# EasyEDA Pro project ProDoc_simpleCH552_typeA_start.epro

# Schematic simpleCH552_typeA_start
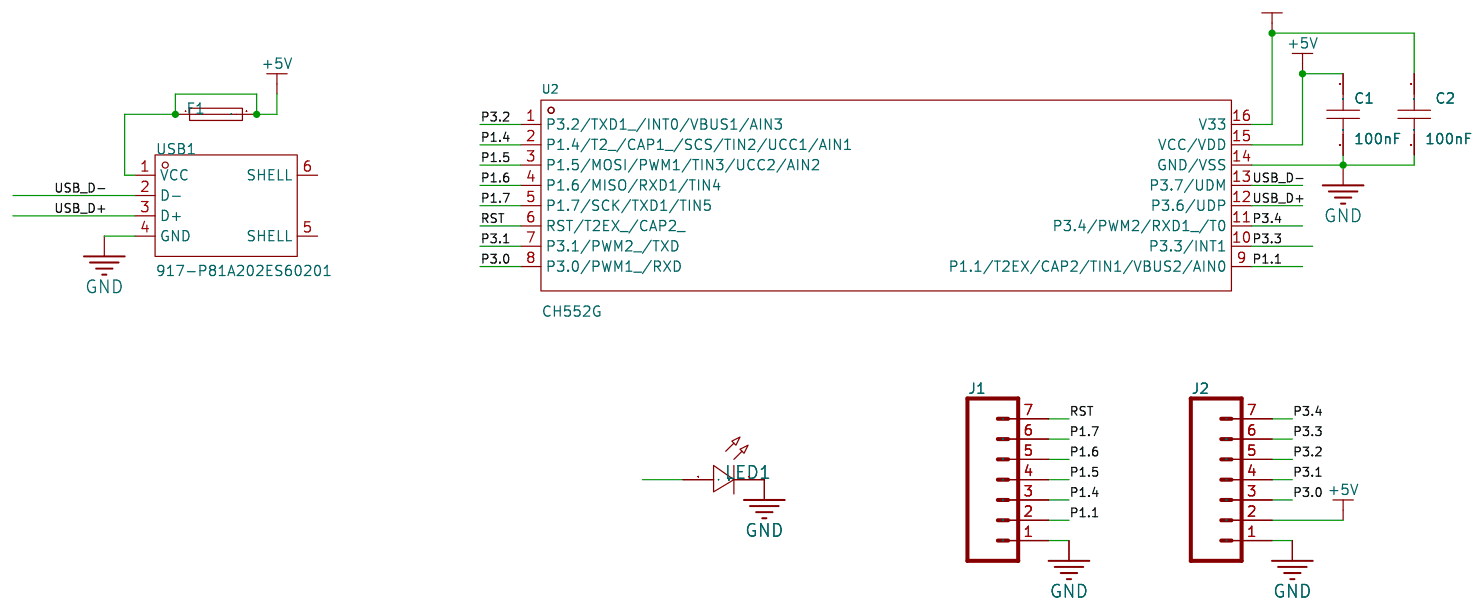
[diagram p0: schematic sheet]

## Parts
C1  100nF  [C0805]
C2  100nF  [C0805]
F1  SF-1206S080-2  [F1206]  (no BOM)
J1  CONN_07NO_SILK  [1X07_NO_SILK]
J2  CONN_07NO_SILK  [1X07_NO_SILK]
LED1  -  [LED0805-RD_GREEN]
U2  CH552G  [SOP-16_L10.0-W3.9-P1.27-LS6.0-BL]
USB1  917-P81A202ES60201  [USB-A-SMD_917-P81A202ES60201]

## Library data of the parts
C1 C2 = CAP_0805: Supplier Footprint: 0805
F1 = SF-1206S080-2: Supplier Part: C3032873; Manufacturer: BOURNS; Supplier Footprint: 1206; JLCPCB Part Class: Extended Part; Datasheet: https://atta.szlcsc.com/upload/public/pdf/source/20220608/65EEC60D8433527F377077C8BDEE03B0.pdf; Supplier: LCSC
J1 J2 = SparkFun-Connectors_CONN_07_NO_SILK
LED1 = LED_0805-R: Supplier Footprint: 0805
U2 = CH552G: CPU Core:51 Series CPU Maximum Speed:24MHz Program Storage Size:16KB Program Memory Type:FLASH ADC (Bit):8bit PWM (Bit):8bit Voltage - Supply:3.3V~5V Voltage - Supply:3.3V~5V Applications:-; LCSC Part Name: 8位增强型USB单片机; Supplier Part: C111292; Manufacturer: WCH(南京沁恒); Supplier Footprint: SOP-16; JLCPCB Part Class: Extended Part; Datasheet: https://item.szlcsc.com/datasheet/CH552G/112518.html; Supplier: LCSC; CPU Core: 51 Series; CPU Maximum Speed: 24MHz; Program Storage Size: 16KB; Program Memory Type: FLASH; ADC (Bit): 8bit; PWM (Bit): 8bit; Voltage - Supply: 3.3V~5V
USB1 = 917-P81A202ES60201: Connector Type:Type-A Standard:USB 2.0 Gender:公 Number of Ports:1 Number of Contacts:4P Mounting Style:Sink board Current Rating - Power (Max):1.5A Operating Temperature Range:- Operating Temperature Range:-; LCSC Part Name: Type-A 公 沉板; Supplier Part: C2763091; Manufacturer: 精拓金; Supplier Footprint: SMD; JLCPCB Part Class: Extended Part; Datasheet: https://atta.szlcsc.com/upload/public/pdf/source/20210526/C2763091_74908644C363FC7F8BB851C47F8BF5A9.pdf; Supplier: LCSC; Connector Type: Type-A; Standard: USB 2.0; Gender: 公; Number of Ports: 1; Number of Contacts: 4P; Mounting Style: Sink board; Current Rating - Power (Max): 1.5A

## Nets
3.3V: C2.1 U2.16(V33)
+5V: C1.1 F1.1 F1.2 J2.2 U2.15(VCC/VDD) USB1.1(VCC)
GND: C1.2 C2.2 J1.1 J2.1 LED1.1(C) U2.14(GND/VSS) USB1.4(GND)
N$3: LED1.2(A)
P1.1: J1.2 U2.9(P1.1/T2EX/CAP2/TIN1/VBUS2/AIN0)
P1.4: J1.3 U2.2(P1.4/T2_/CAP1_/SCS/TIN2/UCC1/AIN1)
P1.5: J1.4 U2.3(P1.5/MOSI/PWM1/TIN3/UCC2/AIN2)
P1.6: J1.5 U2.4(P1.6/MISO/RXD1/TIN4)
P1.7: J1.6 U2.5(P1.7/SCK/TXD1/TIN5)
P3.0: J2.3 U2.8(P3.0/PWM1_/RXD)
P3.1: J2.4 U2.7(P3.1/PWM2_/TXD)
P3.2: J2.5 U2.1(P3.2/TXD1_/INT0/VBUS1/AIN3)
P3.3: J2.6 U2.10(P3.3/INT1)
P3.4: J2.7 U2.11(P3.4/PWM2/RXD1_/T0)
RST: J1.7 U2.6(RST/T2EX_/CAP2_)
USB_D+: U2.12(P3.6/UDP) USB1.3(D+)
USB_D-: U2.13(P3.7/UDM) USB1.2(D-)

Not connected (* = marked no-connect by the designer): USB1 5(SHELL) 6(SHELL)

# Board simpleCH552_typeA_start
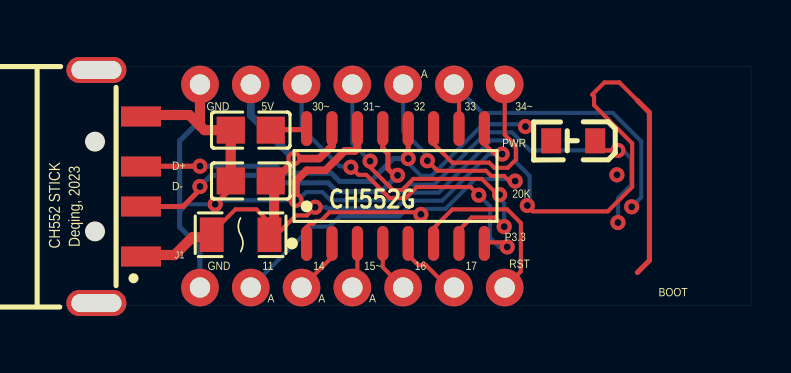
[diagram p1: board, top side]
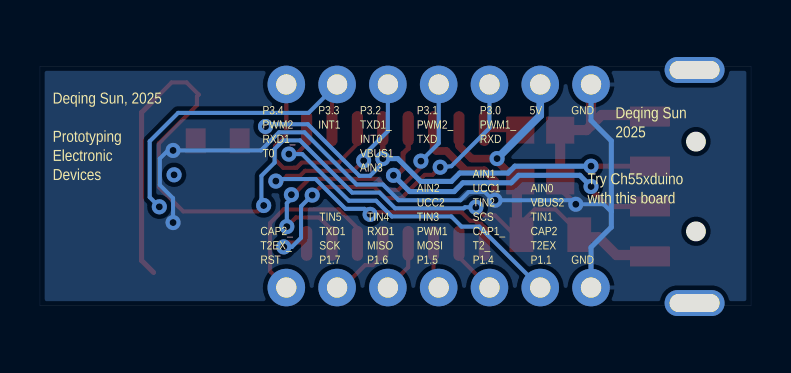
[diagram p2: board, bottom side, seen from below]

Outline 35.56 x 11.99 mm; copper layers: Top Layer, Bottom Layer. Coordinates in mm from the lower left corner of the outline.
Outline path: 0,11.99 0,0 35.56,0 35.56,11.99 0,11.99
Stack: Top Layer 0.035mm / Dielectric1 1.51mm FR4 er 4.5 / Bottom Layer 0.035mm

## Design rules (mm)
template: User Custom Config
spacing safeClearance (default): track to track 0.203, other pairs 0 to 0.508
track width trackWidth: min 0.203, default 0.203, max 2.54
track width default (default): min 0.003, default 0.003, max 2.54
differential pair differentialPair (default): width min 0.127, default 0.254, max 2.54; gap min 0.152, default 0.152
via viaSize: diameter min 0.3, default 0.3, max 2.6; hole min 0.3, default 0.3, max 2
via default (default): diameter min 0, default 0, max 2.6; hole min 0, default 0, max 2
pour ie50 uses CopperRegion

## Placement (name value [footprint] x y rotation side)
C1  100nF  [C0805]  10.54 6.25 180 top
C2  100nF  [C0805]  10.54 8.79 180 top
F1  SF-1206S080-2  [F1206]  10.03 3.56 0 top
J1  CONN_07NO_SILK  [1X07_NO_SILK]  8 0.91 0 top
J2  CONN_07NO_SILK  [1X07_NO_SILK]  8 11.07 0 top
LED1  -  [LED0805-RD_GREEN]  26.67 8.25 180 top
U2  CH552G  [SOP-16_L10.0-W3.9-P1.27-LS6.0-BL]  17.78 5.99 0 top
USB1  917-P81A202ES60201  [USB-A-SMD_917-P81A202ES60201]  3.94 5.97 270 top

## Footprints (pads in the part's own frame, mm; a bottom-side part is the same pattern mirrored in y, then rotated)
1X07_NO_SILK
  round 1.879 hole 1.016: 1(0,0) 2(2.54,0) 3(5.08,0) 4(7.62,0) 5(10.16,0) 6(12.7,0) 7(15.24,0)
C0805
  rect 1.41x1.35 smd: 1(-1,0) 2(1,0)
F1206
  rect 1.19x1.728 smd: 1(-1.445,0) 2(1.445,0)
LED0805-RD_GREEN
  rect 1x1.25 smd: 1(-1.1,0) 2(1.1,0)
SOP-16_L10.0-W3.9-P1.27-LS6.0-BL
  oval 0.56x1.745 smd: 1(-4.445,-2.873) 2(-3.175,-2.873) 3(-1.905,-2.873) 4(-0.635,-2.873) 5(0.635,-2.873) 6(1.905,-2.873) 7(3.175,-2.873) 8(4.445,-2.873) 9(4.445,2.873) 10(3.175,2.873) 11(1.905,2.873) 12(0.635,2.873) 13(-0.635,2.873) 14(-1.905,2.873) 15(-3.175,2.873) 16(-4.445,2.873)
USB-A-SMD_917-P81A202ES60201
  rect 1x2 smd: 1(3.5,1.115) 2(1,1.115) 3(-1,1.115) 4(-3.5,1.115)
  oval 1.3x3 hole 0.9x2.5: 5(-5.83,-1.115) 6(5.83,-1.115)

## Nets
As in the schematic.

Pads without a net: USB1 5 6

## Via types
v1: diameter 0.756, hole 0.35, Top Layer to Bottom Layer, 24 vias

## Routing (per net, layer and track width the routed paths; a pad name or vN(x,y) marks a point on that pad's centre or on a via; arc(x,y) is an arc through that point)
3.3V: length 1.8
  Top Layer w0.254: 13.34,8.81 11.57,8.81 C2.1
+5V: length 60.7
  Top Layer w0.203: v1(24.37,5.02) 24.67,4.72 28.4,4.72 29.62,5.94 29.62,8.13 27.71,10.03 27.71,10.47 27.62,10.57 28.23,11.18 28.97,11.18 29.88,10.27 ; 11.71,3.94 10.82,4.83 9.78,4.83 8.87,3.91 8.87,3.43 ; v1(13.76,4.93) 13.35,4.52 12.8,4.52 11.71,3.43
  Top Layer w0.254: 29.88,10.27 30.48,9.67 30.48,2.27 29.88,1.67 ; v1(12.7,7.37) 12.7,7.24
  Top Layer w0.305: 11.71,6.25 C1.1
  Top Layer w0.381: v1(12.7,7.37) 13.97,7.37 14.6,8 14.6,8.81 ; 12.7,7.24 11.71,6.25
  Top Layer w0.508: 5.62,2.49 5.66,2.54 6.73,2.54 7.62,3.43 8.87,3.43 ; 11.71,3.43 11.71,6.1 11.56,6.25
  Bottom Layer w0.203: v1(13.76,4.93) 14.31,4.93 14.36,4.88 17.8,4.88 18.58,5.66 19.95,5.66 22.55,8.27 23.4,8.27 23.82,7.84 23.82,7.16 24.49,6.5 24.49,5.33 24.37,5.22 v1(24.37,5.02)
  Bottom Layer w0.381: J2.2 10.54,9.53 v1(12.7,7.37)
GND: length 57.2
  Top Layer w0.203: 27.72,8.28 28.23,7.77 v1(28.91,7.77)
  Top Layer w0.254: v1(8.76,5.08) 9.54,5.86 C1.2
  Top Layer w0.381: 15.88,8.81 15.88,7.87 15.75,7.75 15.24,7.75 14.28,6.78 13.34,6.78 12.8,6.25 v1(12.8,5.28)
  Top Layer w0.508: 8,9.02 8.23,8.79 C2.2 C1.2 ; 8,9.02 J2.1 ; 8,9.02 7.47,9.55 5.62,9.55
  Bottom Layer w0.203: v1(28.91,4.17) 28.91,5.39 29.57,6.05 29.57,7.37 29.16,7.77 v1(28.91,7.77) 24.51,7.77 23.6,8.68 22.33,8.68 19.73,6.07 18.41,6.07 17.63,5.28 14.53,5.28 14.12,5.69 13.31,5.69 12.9,5.28 v1(12.8,5.28) 8.71,5.28 8.71,5.13 v1(8.76,5.08) 7.37,5.08 6.99,4.7
  Bottom Layer w0.254: J2.1 8,9.27 6.99,8.25 6.99,3.94 8,2.92 J1.1
N$1:
  vias: v1(28.85,6.55)
P1.1: length 17.2
  Top Layer w0.203: 22.22,8.81 22.2,8.79 22.2,8.13 22.74,7.59 v1(23.11,7.59)
  Bottom Layer w0.203: v1(23.11,7.59) 22.45,7.59 20.11,5.26 18.75,5.26 17.96,4.47 14.99,4.47 14.48,3.96 13.59,3.96 J1.2
P1.4: length 2.9
  Top Layer w0.203: 14.6,3.17 14.6,2.44 13.08,0.91
P1.5: length 2.4
  Top Layer w0.203: J1.4 15.88,1.17 15.88,3.17
P1.6: length 2.7
  Top Layer w0.203: J1.5 17.15,1.93 17.15,3.17
P1.7: length 3.6
  Top Layer w0.203: J1.6 20.52,1.09 20.24,1.09 19.3,2.03 18.92,2.03 18.41,2.54 18.41,3.17
P3.0: length 17.5
  Top Layer w0.203: v1(21.95,5.54) 21.54,5.94 18.84,5.94 18.28,5.39 17.48,5.39 16.32,6.55 15.93,6.55 v1(15.54,6.93) ; v1(23.37,2.95) 23.14,3.17 22.22,3.17
  Bottom Layer w0.203: v1(21.95,5.54) 22.5,4.98 22.5,3.4 22.96,2.95 v1(23.37,2.95) ; 13.08,11.07 13.08,8.89 14.99,6.98 v1(15.54,6.93)
P3.1: length 17
  Top Layer w0.203: v1(22.99,5.56) 22.89,5.56 22.1,6.35 18.67,6.35 18.11,5.79 17.65,5.79 16.51,6.93 v1(16.51,7.24) ; v1(23.22,3.96) 22.76,4.42 21.59,4.42 20.96,3.78 20.96,3.17
  Bottom Layer w0.203: v1(16.51,7.24) 15.62,8.13 J2.4 ; v1(22.99,5.56) 22.99,5.36 23.22,5.13 v1(23.22,3.96)
P3.2: length 21.5
  Top Layer w0.203: 13.34,3.17 13.34,3.94 13.51,4.11 13.67,4.11 13.81,4.25 14.04,4.25 14.48,4.68 18.94,4.68 v1(19.05,4.58) ; v1(19.37,7.26) 19.88,6.76 22.3,6.76 22.56,6.5 23.21,6.5 23.47,6.24 v1(23.77,6.24)
  Bottom Layer w0.203: v1(19.37,7.26) 19.37,7.52 18.16,8.74 J2.5 ; v1(23.77,6.24) 23.66,6.34 21.77,6.34 20.28,4.85 19.33,4.85 v1(19.05,4.58)
P3.3: length 16.4
  Top Layer w0.203: 20.96,8.81 20.96,10.82 J2.6
  Bottom Layer w0.203: v1(29.59,4.95) 30.07,5.44 30.07,8.23 28.65,9.65 22.12,9.65 J2.6
P3.4: length 9.5
  Top Layer w0.203: 19.69,8.81 19.69,8.1 20.62,7.16 22.47,7.16 22.72,6.91 22.83,6.91 22.83,6.91 23.4,6.91 23.8,7.31 23.8,8 23.24,8.56 J2.7
RST: length 9.3
  Top Layer w0.203: 19.69,3.17 19.69,3.89 20.62,4.83 23.37,4.83 24.05,4.14 24.05,1.72 J1.7
USB_D+: length 22.5
  Top Layer w0.254: 5.62,7.02 5.65,6.98 v1(8,6.98) ; 18.41,8.81 v1(18.41,7.37)
  Bottom Layer w0.203: v1(18.41,7.37) 18.41,7.14 19.05,6.5 19.58,6.5 22.17,9.08 24.16,9.08 v1(24.28,8.97)
  Bottom Layer w0.254: v1(8,6.98) 11.81,6.98 12.15,6.64 14.57,6.64 14.99,6.22 16.52,6.22 17.67,7.37 v1(18.41,7.37)
USB_D-: length 16.4
  Top Layer w0.254: v1(8,5.97) 8,5.82 7.15,4.97 5.62,4.97 ; v1(17.88,6.53) 17.73,6.53 17.4,6.86 17.4,7.62 17.15,7.87 17.15,8.81
  Bottom Layer w0.254: v1(17.88,6.53) 17.07,5.72 14.85,5.72 14.41,6.15 12,6.15 11.62,6.53 8.56,6.53 v1(8,5.97)

## Copper pours and planes (outline as drawn; the poured copper is in the pictures)
GND on Bottom Layer: 0,0 35.56,0 35.56,11.99 0,11.99

## Text on the board
Bottom Silkscreen Layer: GND | 5V | P3.0 / PWM1_ / RXD | P3.1 / PWM2_ / TXD | P3.2 / TXD1_ / INT0 / VBUS1 / AIN3 | P3.3 / INT1 | P3.4 / PWM2 / RXD1_ / T0 | AIN0 / VBUS2 / TIN1 / CAP2 / T2EX / P1.1 | AIN1 / UCC1 / TIN2 / SCS / CAP1_ / T2_ / P1.4 | AIN2 / UCC2 / TIN3 / PWM1 / MOSI / P1.5 | TIN4 / RXD1 / MISO / P1.6 | TIN5 / TXD1 / SCK / P1.7 | CAP2_ / T2EX_ / RST | Deqing Sun / 2025 | Try Ch55xduino / with this board | Deqing Sun, 2025 / Prototyping / Electronic / Devices
Top Silkscreen Layer: CH552G | D+ | D- | GND | 5V | 11 | A | 30~ | 14 | 31~ | 15~ | 32 | 16 | 33 | 17 | PWR | P3.3 | RST | 20K | 34~ | BOOT | CH552 STICK | Deqing, 2023
